# EAGLE schematic pinconnections (EAGLE 8.2.2)
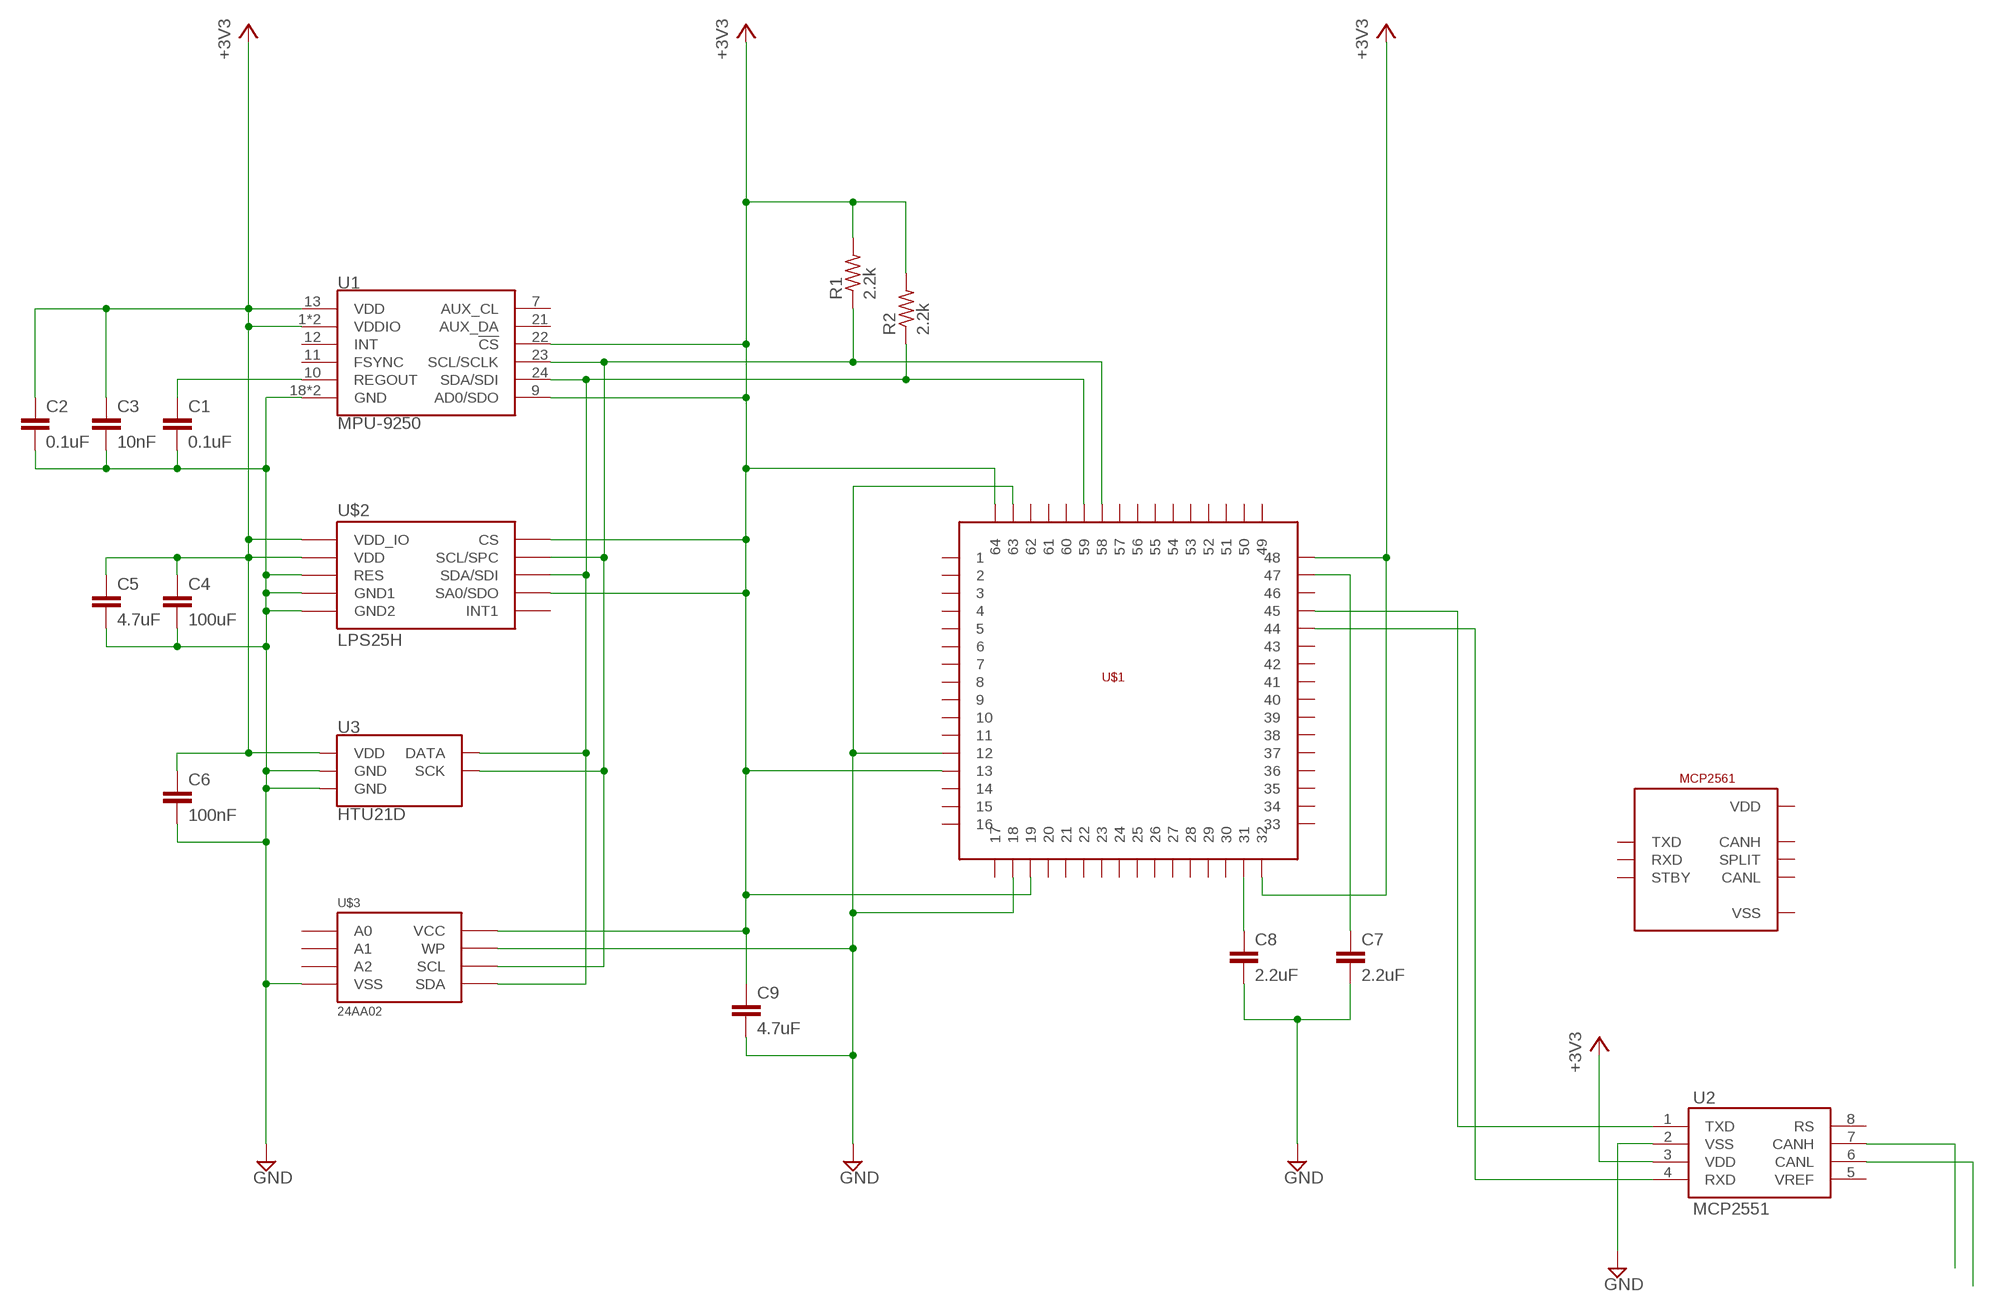
[diagram p0: schematic, sheet 1]

## Parts
C1  0.1uF  C-EU025-025X050  [C025-025X050]
C2  0.1uF  C-EU025-025X050  [C025-025X050]
C3  10nF  C-EU025-025X050  [C025-025X050]
C4  100uF  C-EU025-025X050  [C025-025X050]
C5  4.7uF  C-EU025-025X050  [C025-025X050]
C6  100nF  C-EU025-025X050  [C025-025X050]
C7  2.2uF  C-EU025-025X050  [C025-025X050]
C8  2.2uF  C-EU025-025X050  [C025-025X050]
C9  4.7uF  C-EU025-025X050  [C025-025X050]
R1  2.2k  R-US_0204/5  [0204/5]
R2  2.2k  R-US_0204/5  [0204/5]
U1  MPU-9250  [QFN24-3X3]
U2  MCP2551  [SO08]
U3  HTU21D  [DFN-6-3X3-HTU21D]
U$1  STM32F405RG  [STM32F405RG]
U$2  LPS25H  [LPS25H]
U$3  24AA02  [SO-08M]
U$4  MCP2561  [SOIC8]

## Nets
+3V3: U$1.32 U$1.48
GND: C1.2 C2.2 C3.2 C4.2 C5.2 C6.2 C7.2 C8.2 C9.2 U2.2(VSS) U3.7(GND) U3.GND U$1.12 U$1.18 U$1.63 U$2.3(RES) U$2.8(GND1) U$2.9(GND2) U$3.4(VSS) U$3.7(WP)
N$1: C8.1 U$1.31
N$2: C1.1 U1.10(REGOUT)
N$3: U2.1(TXD) U$1.45
N$4: U1.18(GND) U1.20(GND)
N$5: U2.4(RXD) U$1.44
N$6: U2.6(CANL)
N$7: U2.7(CANH)
N$8: C7.1 U$1.47
SCL: R1.1 U1.23(SCL/SCLK) U3.SCK U$1.58 U$2.2(SCL/SPC) U$3.6(SCL)
SDA: R2.1 U1.24(SDA/SDI) U3.DATA U$1.59 U$2.4(SDA/SDI) U$3.5(SDA)
VDD: C2.1 C3.1 C4.1 C5.1 C6.1 C9.1 R1.2 R2.2 U1.1(VDDIO) U1.8(VDDIO) U1.9(AD0/SDO) U1.13(VDD) U1.22(!CS) U2.3(VDD) U3.VDD U$1.13 U$1.19 U$1.64 U$2.1(VDD_IO) U$2.5(SA0/SDO) U$2.6(CS) U$2.10(VDD) U$3.8(VCC) ; supply symbol labelled +3V3
Unconnected: U1.7(AUX_CL) U1.11(FSYNC) U1.12(INT) U1.21(AUX_DA) U2.5(VREF) U2.8(RS) U$1.1 U$1.2 U$1.3 U$1.4 U$1.5 U$1.6 U$1.7 U$1.8 U$1.9 U$1.10 U$1.11 U$1.14 U$1.15 U$1.16 U$1.17 U$1.20 U$1.21 U$1.22 U$1.23 U$1.24 U$1.25 U$1.26 U$1.27 U$1.28 U$1.29 U$1.30 U$1.33 U$1.34 U$1.35 U$1.36 U$1.37 U$1.38 U$1.39 U$1.40 U$1.41 U$1.42 U$1.43 U$1.46 U$1.49 U$1.50 U$1.51 U$1.52 U$1.53 U$1.54 U$1.55 U$1.56 U$1.57 U$1.60 U$1.61 U$1.62 U$2.7(INT1) U$3.1(A0) U$3.2(A1) U$3.3(A2) U$4.P$1(TXD) U$4.P$2(VSS) U$4.P$3(VDD) U$4.P$4(RXD) U$4.P$5(SPLIT) U$4.P$6(CANL) U$4.P$7(CANH) U$4.P$8(STBY)

## Library data of the parts
C1-C9 = rcl:C-EU: CAPACITOR, European symbol
R1 R2 = resistor:R-US_: RESISTOR, American symbol
U1 = SparkFun-Sensors:MPU-9250: MPU-9250 9 Degree of Freedom IMU System in Package that contains MPU-6500 & AK8963 NC pin 19. 2-6 & 14-17 not internally connected. May be used for PCB trace routing. Datasheet <https://cdn.sparkfun.com/assets/learn_tutorials/5/5/0/MPU9250REV1.0.pdf> SparkFun Products: SparkFun 9DoF Razor IMU M0 <https://www.sparkfun.com/products/14001> SparkFun IMU Breakout - MPU-9250 <https://www.sparkfun.com/products/13762>; PROD_ID: IC-13192; VALUE: 9DoF IMU
U2 = SparkFun-IC-Comms:MCP2551: MCP2551 High Speed CAN Transceiver High speed CAN transceiver Datasheet <http://www.sparkfun.com/datasheets/DevTools/Arduino/MCP2551.pdf> SparkFun Products CAN-BUS Shield <https://www.sparkfun.com/products/13262> (DEV-13262) SparkFun OBD-II UART <https://www.sparkfun.com/products/9555> (WIG-09555); PROD_ID: IC-09907
U3 = SparkFun-Sensors:HTU21D: Measurement Specialties HTU21D Relative Humidity Sensor w/ Temperature HTU21D(F) digital humidity sensors are dedicated humidity and temperature plug and play transducers for OEM applications where reliable and accurate measurements are needed. Direct interface with a micro-controller is made possible with the module for humidity and temperature digital outputs. These low power sensors are designed for high volume and cost sensitive applications with tight space constraints. Datasheet <http://cdn.sparkfun.com/datasheets/BreakoutBoards/HTU21D.pdf> SparkFun Products SparkFun Humidity and Temperature Sensor Breakout - HTU21D <https://www.sparkfun.com/products/12064> (SEN-12064) SparkFun Weather Shield <https://www.sparkfun.com/products/12081> (SEN-12081) SparkFun Photon Weather Shield <https://www.sparkfun.com/products/13630> (SEN-13630); PROD_ID: IC-11793
U$1 = st-microelectronics:STM32F405RG
U$2 = st-microelectronics:LPS25H
U$3 = microchip:24AA02
U$4 = MCP2561:MCP2561; AVAILABILITY: Warning; DESCRIPTION: MCP2561 Series 5.5 V 8 Mbps High-Speed CAN Flexible Data Rate Transceiver-SOIC-8; MF: Microchip; MP: MCP2561FD-E/SN; PACKAGE: SOIC-8 Microchip; PRICE: 0.91 USD